# EAGLE board LED_panel_rev3.15 (EAGLE 9.0.1), part 1 of 2
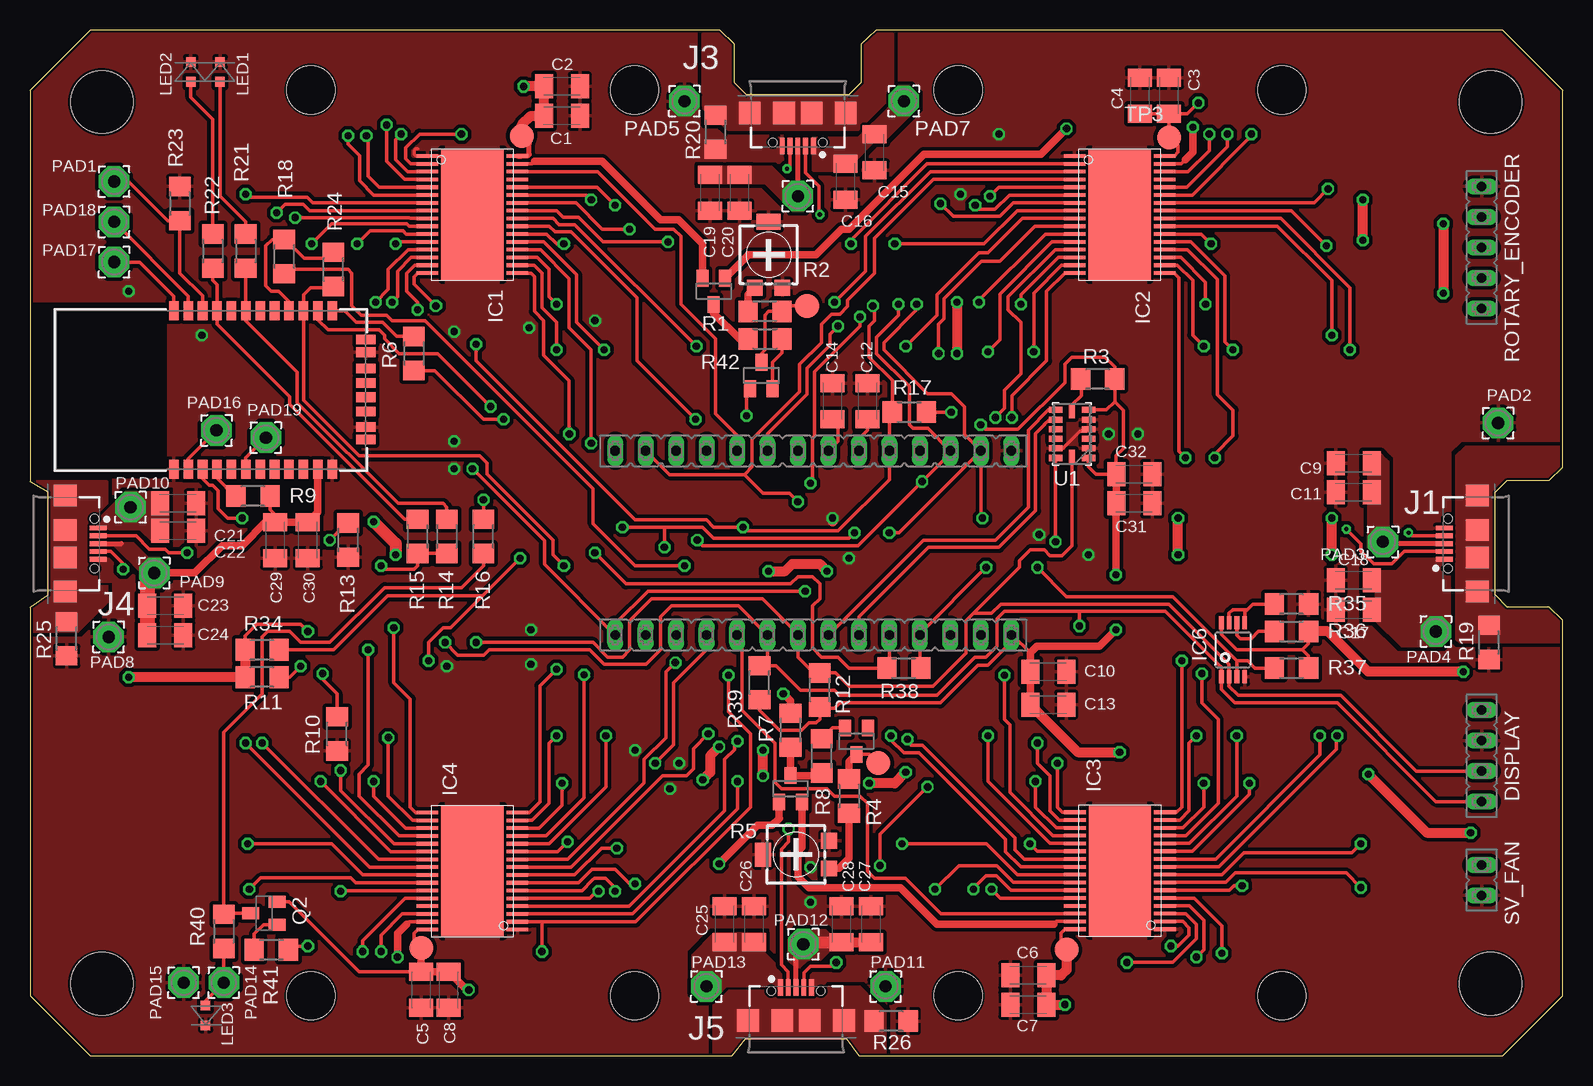
[diagram p7: board, top side]
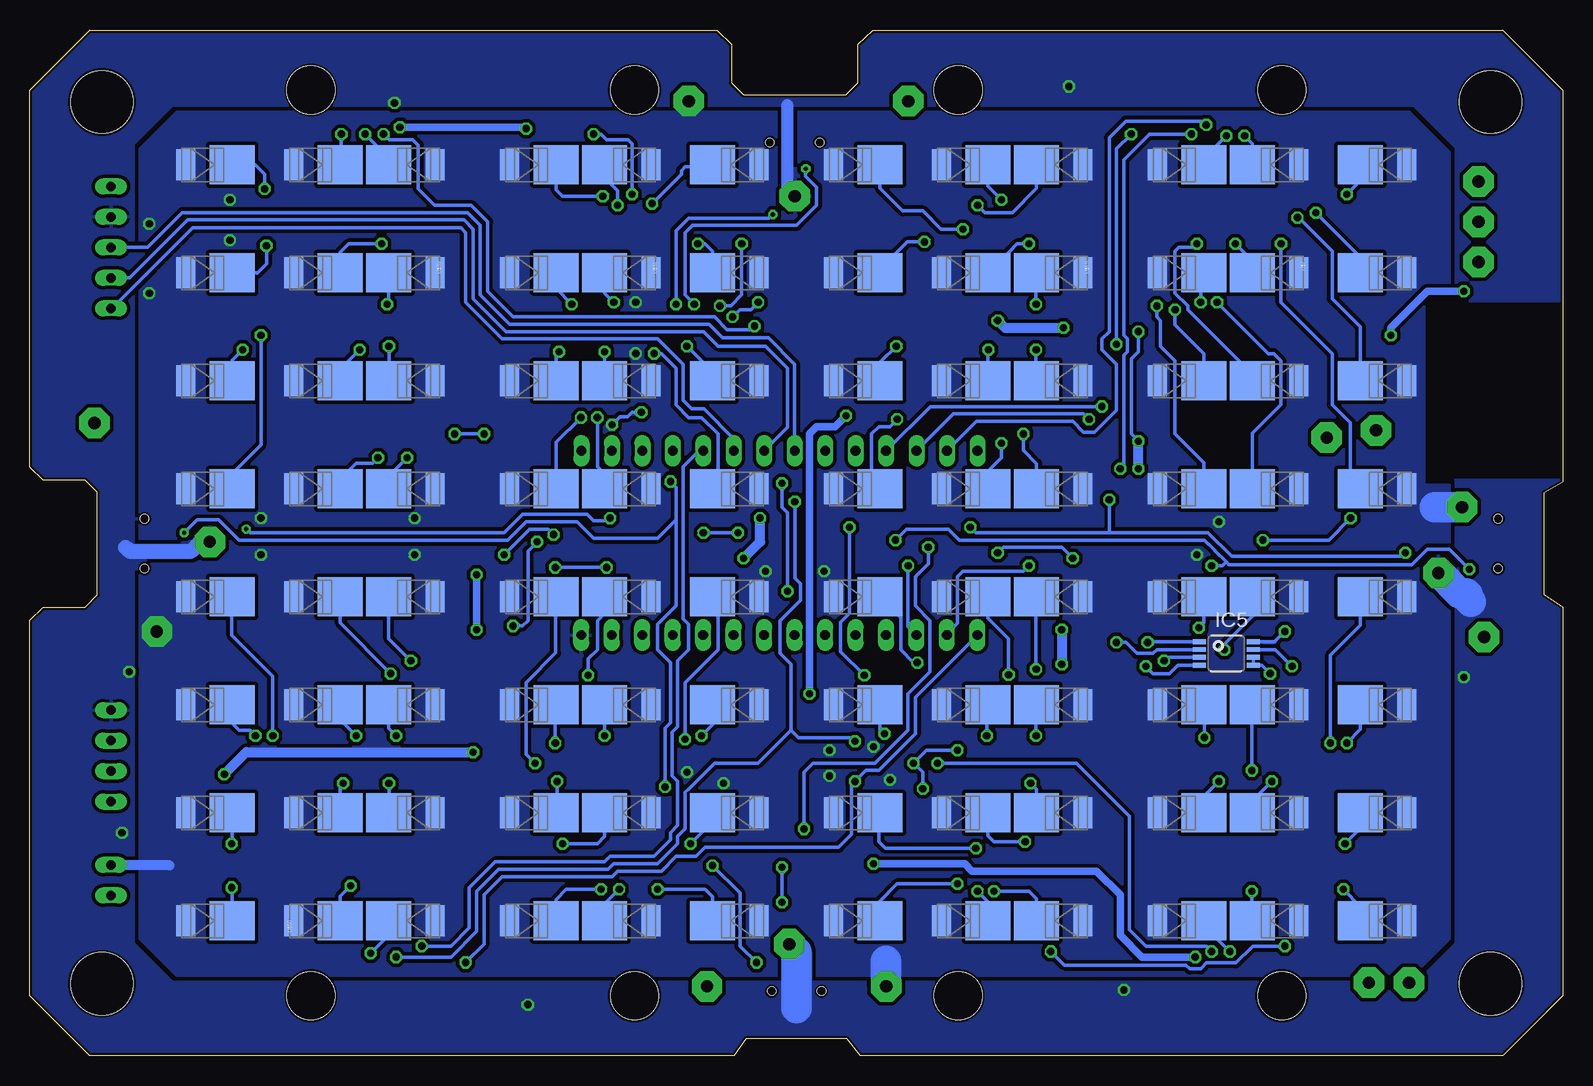
[diagram p8: board, bottom side, seen from below]

Size 127.76 x 85.48 mm. Coordinates in mm from the lower left corner, seen from the top.
Outline: 5,0 58.52,0 59.64,1.41 68.08,1.41 69.09,0 122.76,0 127.76,5 127.76,36.3 126.67,37.39 123.16,37.39 122.15,38.41 122.15,46.94 123.16,47.95 126.67,47.95 127.76,49.05 127.76,80.48 122.76,85.48 70.51,85.48 69.29,84.31 69.29,81.08 68.28,80.07 59.74,80.07 58.73,81.08 58.73,84.31 57.51,85.48 5,85.48 0,80.48 0,47.85 1.51,46.94 1.51,38.41 0,37.39 0,5 5,0
Copper layers (1*16): Top 0.035mm / dielectric 1mm / Bottom 0.035mm
Design rules "default *": minimum track width 6mil, minimum drill 0.3mm, track to track 8mil, track to pad 8mil, pad to pad 8mil, via to via 8mil, smd to smd 8mil, copper to edge 0.2mm, drill to drill 8mil, minimum pad ring 10mil, minimum via ring 8mil, stop-mask expansion 0mil, vias tented up to drill 0mil, thermal gap 10mil
Net classes: 1 supply: width 0.152 mm, clearance 0.229 mm to class 0, clearance 0.305 mm
Holes 5.2 mm at 6,79.48 6,6 121.76,79.48 121.76,6
Holes 4 mm at 50.39,5 77.37,5 23.41,5 104.35,5 50.39,80.48 77.37,80.48 23.41,80.48 104.35,80.48

## Footprints (pad centres in the part's own frame; a part is rotated, then mirrored left to right if it is on the bottom)
C1206K = smd 1.5 x 2: 1 -1.5,0; 2 1.5,0
FE04 = drill 0.813 long: 1 -3.81,0; 2 -1.27,0; 3 1.27,0; 4 3.81,0
FE14 = drill 0.813 long: 1 -16.51,0; 2 -13.97,0; 3 -11.43,0; 4 -8.89,0; 5 -6.35,0; 6 -3.81,0; 7 -1.27,0; 8 1.27,0; 9 3.81,0; 10 6.35,0; 11 8.89,0; 12 11.43,0; 13 13.97,0; 14 16.51,0
HTSSOP32DAP = smd 0.3 x 1.8: 1 -4.875,-3.75; 2 -4.225,-3.75; 3 -3.575,-3.75; 4 -2.925,-3.75; 5 -2.275,-3.75; 6 -1.625,-3.75; 7 -0.975,-3.75; 8 -0.325,-3.75; 9 0.325,-3.75; 10 0.975,-3.75; 11 1.625,-3.75; 12 2.275,-3.75; 13 2.925,-3.75; 14 3.575,-3.75; 15 4.225,-3.75; 16 4.875,-3.75; 17 4.875,3.75; 18 4.225,3.75; 19 3.575,3.75; 20 2.925,3.75; 21 2.275,3.75; 22 1.625,3.75; 23 0.975,3.75; 24 0.325,3.75; 25 -0.325,3.75; 26 -0.975,3.75; 27 -1.625,3.75; 28 -2.275,3.75; 29 -2.925,3.75; 30 -3.575,3.75; 31 -4.225,3.75; 32 -4.875,3.75 | smd 11 x 5.2: EXP 0,0
MSOP8 = smd 0.4 x 1.1: 1 -0.975,-2.25; 2 -0.325,-2.25; 3 0.325,-2.25; 4 0.975,-2.25; 5 0.975,2.25; 6 0.325,2.25; 7 -0.325,2.25; 8 -0.975,2.25
629105136821 = smd 0.4 x 1.4: 1 -1.3,0.5; 2 -0.65,0.5; 3 0,0.5; 4 0.65,0.5; 5 1.3,0.5 | smd 1.8 x 1.9: 6 1.15,-2.25; 7 -1.15,-2.25; 8 4,-2.25; 9 -4,-2.25 | hole 0.7: -2.075,0.2; 2.075,0.2
MH_KINGBRIGHT_1.6X0.8 = smd 0.8 x 0.8: A 0.825,0; C -0.825,0
2,54/1,0 = drill 1.016 pad 2.54 octagon: 1 0,0
SOT23-BEC = smd 1 x 1.4: B -0.95,-1.1; C 0,1.1; E 0.95,-1.1
R1206 = smd 1.6 x 1.803: 1 -1.422,0; 2 1.422,0
RTRIM4G/J = smd 1.3 x 1.3: 1 -1.15,-2.75; 3 1.15,-2.75 | smd 2 x 1.3: 2 0,2.75
FE05 = drill 0.813 long: 1 -5.08,0; 2 -2.54,0; 3 0,0; 4 2.54,0; 5 5.08,0
FE02 = drill 0.813 long: 1 -1.27,0; 2 1.27,0
TP20R = smd 2 x 2: TP 0,0
LGA14R80P3X6_300X500X100 = smd 1.118 x 0.508: 1 -1.372,2.007; 2 -1.372,1.194; 3 -1.372,0.406; 4 -1.372,-0.406; 5 -1.372,-1.194; 6 -1.372,-2.007; 8 1.372,-2.007; 9 1.372,-1.194; 10 1.372,-0.406; 11 1.372,0.406; 12 1.372,1.194; 13 1.372,2.007 | smd 0.508 x 1.118: 7 0,-1.88; 14 0,1.88
SMD_CERAMIC_MID_POWER = smd 2.6 x 1.6: P$1 0,1.4 | smd 3.26 x 3.75: P$2 0,-2.475
RN41 = smd 0.8 x 1.6: 1 -6.6,-6.6; 2 -5.4,-6.6; 3 -4.2,-6.6; 4 -3,-6.6; 5 -1.8,-6.6; 6 -0.6,-6.6; 7 0.6,-6.6; 8 1.8,-6.6; 9 3,-6.6; 10 4.2,-6.6; 11 5.4,-6.6; 12 6.6,-6.6; 13 6.6,6.6; 14 5.4,6.6; 15 4.2,6.6; 16 3,6.6; 17 1.8,6.6; 18 0.6,6.6; 19 -0.6,6.6; 20 -1.8,6.6; 21 -3,6.6; 22 -4.2,6.6; 23 -5.4,6.6; 24 -6.6,6.6 | smd 1.6 x 0.8: 28 9.4,3.15; 29 9.4,-3.08; 30 9.4,4.2; 31 9.4,1.8; 32 9.4,0.6; 33 9.4,-0.6; 34 9.4,-1.8; 35 9.4,-4.12
SOT23 = smd 1 x 1.4: 1 -0.95,-1.1; 2 0.95,-1.1; 3 0,1.1

## Placement (x,y rotation side)
C1  100n  [C1206K]  44.35,78.33 180 top
C2  10u/16V  [C1206K]  44.35,80.77 180 top
C3  100n  [C1206K]  94.95,80.01 270 top
C4  10u/16V  [C1206K]  92.51,80.01 270 top
C5  100n  [C1206K]  32.61,5.49 90 top
C6  10u/16V  [C1206K]  83.21,6.71 0 top
C7  100n  [C1206K]  83.21,4.27 0 top
C8  10u/16V  [C1206K]  34.9,5.49 90 top
C9  100n  [C1206K]  110.34,49.38 180 top
C10  100n  [C1206K]  84.89,32 0 top
C11  100u / 6V3  [C1206K]  110.34,46.94 180 top
C12  100n  [C1206K]  66.9,54.56 270 top
C13  10u/16V  [C1206K]  84.89,29.26 0 top
C14  100n  [C1206K]  69.8,54.56 270 top
C15  100n  [C1206K]  70.41,75.29 270 top
C16  100u / 6V3  [C1206K]  67.97,72.85 270 top
C17  100n  [C1206K]  110.34,37.19 180 top
C18  100u / 6V3  [C1206K]  110.34,39.62 180 top
C19  100n  [C1206K]  56.69,71.93 270 top
C20  100u / 6V3  [C1206K]  59.13,71.93 270 top
C21  100n  [C1206K]  12.34,46.02 0 top
C22  100u / 6V3  [C1206K]  12.34,43.74 0 top
C23  100n  [C1206K]  11.28,37.49 0 top
C24  100u / 6V3  [C1206K]  11.28,35.05 0 top
C25  100n  [C1206K]  57.91,10.97 90 top
C26  100u / 6V3  [C1206K]  60.35,10.97 90 top
C27  100n  [C1206K]  70.1,10.97 90 top
C28  100u / 6V3  [C1206K]  67.67,10.97 90 top
C29  10u/16V  [C1206K]  20.42,42.98 270 top
C30  100n  [C1206K]  23.16,42.98 270 top
C31  10u/16V  [C1206K]  92.05,46.02 0 top
C32  100n  [C1206K]  92.05,48.46 0 top
DISPLAY  FE04-1  [FE04]  121.01,24.99 90 top
FE01  FE14-1  [FE14]  65.29,50.42 180 top
FE02  FE14-1  [FE14]  65.3,35.06 0 top
IC1  TLC5947-DAP  [HTSSOP32DAP]  36.88,70.1 270 top
IC2  TLC5947-DAP  [HTSSOP32DAP]  90.83,70.1 270 top
IC3  TLC5947-DAP  [HTSSOP32DAP]  90.86,15.42 90 top
IC4  TLC5947-DAP  [HTSSOP32DAP]  36.88,15.39 90 top
IC5  MCP9808  [MSOP8]  28.04,33.53 270 bottom
IC6  MCP9808  [MSOP8]  100.28,33.83 0 top
J1  WE_629105136821  [629105136821]  118.41,42.67 90 top
J3  WE_629105136821  [629105136821]  64.01,76.31 180 top
J4  WE_629105136821  [629105136821]  5.18,42.67 270 top
J5  WE_629105136821  [629105136821]  63.86,5.18 0 top
LED1  KPT-1608LVSECK-J3-PRV  [MH_KINGBRIGHT_1.6X0.8]  15.85,81.99 270 top
LED2  KPT-1608LVZGCK  [MH_KINGBRIGHT_1.6X0.8]  13.41,81.99 270 top
LED3  KPT-1608LVSECK-J3-PRV  [MH_KINGBRIGHT_1.6X0.8]  14.63,3.35 90 top
PAD1  [2,54/1,0]  7.01,72.85 90 top
PAD2  GND  [2,54/1,0]  122.38,52.73 0 top
PAD3  +3V3  [2,54/1,0]  112.78,42.82 0 top
PAD4  VCC  [2,54/1,0]  117.2,35.36 0 top
PAD5  GND  [2,54/1,0]  54.56,79.55 0 top
PAD6  +3V3  [2,54/1,0]  64.01,71.63 0 top
PAD7  VCC  [2,54/1,0]  72.85,79.55 0 top
PAD8  GND  [2,54/1,0]  6.55,34.9 0 top
PAD9  +3V3  [2,54/1,0]  10.36,40.23 0 top
PAD10  VCC  [2,54/1,0]  8.38,45.72 0 top
PAD11  GND  [2,54/1,0]  71.32,5.79 0 top
PAD12  +3V3  [2,54/1,0]  64.47,9.3 0 top
PAD13  VCC  [2,54/1,0]  56.39,5.79 0 top
PAD14  [2,54/1,0]  16.15,6.1 0 top
PAD15  [2,54/1,0]  12.8,6.1 0 top
PAD16  [2,54/1,0]  15.54,52.12 0 top
PAD17  [2,54/1,0]  7.01,66.14 0 top
PAD18  [2,54/1,0]  7.01,69.49 0 top
PAD19  [2,54/1,0]  19.66,51.51 0 top
Q2  BC807-16SMD  [SOT23-BEC]  19.51,11.89 90 top
R1  1K  [R1206]  61.26,62.03 0 top
R2  5K  [RTRIM4G/J]  61.57,66.75 0 top
R3  10K  [R1206]  89,56.39 0 top
R4  1K  [R1206]  68.28,21.64 90 top
R5  5K  [RTRIM4G/J]  63.86,16.76 90 top
R6  1K  [R1206]  32,58.52 90 top
R7  0R  [R1206]  63.4,27.13 270 top
R8  0R  [R1206]  65.99,24.99 270 top
R9  10K  [R1206]  18.59,46.63 0 top
R10  10K  [R1206]  25.6,26.82 270 top
R11  10K  [R1206]  19.35,31.55 0 top
R12  4K7  [R1206]  65.84,30.48 270 top
R13  10K  [R1206]  26.52,42.98 90 top
R14  0R  [R1206]  34.75,43.28 90 top
R15  0R  [R1206]  32.31,43.28 90 top
R16  0R  [R1206]  37.8,43.28 270 top
R17  10K  [R1206]  73.3,53.64 180 top
R18  1K  [R1206]  21.18,66.6 90 top
R19  0R  [R1206]  121.62,34.44 270 top
R20  0R  [R1206]  57.15,76.96 270 top
R21  750R  [R1206]  17.98,67.06 90 top
R22  330R  [R1206]  15.24,67.06 90 top
R23  10K  [R1206]  12.5,71.02 90 top
R24  0R  [R1206]  25.3,65.53 270 top
R25  0R  [R1206]  3.05,34.75 270 top
R26  0R  [R1206]  71.78,2.9 0 top
R34  10K  [R1206]  19.35,33.83 0 top
R35  10K  [R1206]  105.16,37.64 0 top
R36  10K  [R1206]  105.16,35.36 180 top
R37  10K  [R1206]  105.16,32.31 180 top
R38  0R  [R1206]  72.85,32.31 180 top
R39  4K7  [R1206]  60.81,31.09 270 top
R40  750R  [R1206]  16.15,10.36 90 top
R41  1K  [R1206]  20.12,8.84 180 top
R42  0R  [R1206]  61.26,59.74 180 top
ROTARY_ENCODER  FE05-1  [FE05]  121.01,67.36 270 top
SV_FAN  FE02-1  [FE02]  121.01,14.63 270 top
TP1  TPTP20R  [TP20R]  41,76.66 0 top
TP3  TPTP20R  [TP20R]  94.95,76.5 0 top
TP5  TPTP20R  [TP20R]  86.41,8.84 0 top
TP7  TPTP20R  [TP20R]  32.61,8.99 0 top
TP9  TPTP20R  [TP20R]  64.77,62.48 0 top
TP10  TPTP20R  [TP20R]  70.71,24.38 0 top
U1  ADXL345BCCZ  [LGA14R80P3X6_300X500X100]  86.87,51.82 180 top
U$1  VLMU1610-365-135  [SMD_CERAMIC_MID_POWER]  32.38,74.24 90 bottom
U$2  VLMU1610-365-135  [SMD_CERAMIC_MID_POWER]  23.38,74.24 270 bottom
U$3  VLMU1610-365-135  [SMD_CERAMIC_MID_POWER]  14.38,74.24 270 bottom
U$4  VLMU1610-365-135  [SMD_CERAMIC_MID_POWER]  14.38,65.24 270 bottom
U$5  VLMU1610-365-135  [SMD_CERAMIC_MID_POWER]  14.38,56.24 270 bottom
U$6  VLMU1610-365-135  [SMD_CERAMIC_MID_POWER]  14.38,47.24 270 bottom
U$7  VLMU1610-365-135  [SMD_CERAMIC_MID_POWER]  23.38,65.24 270 bottom
U$8  VLMU1610-365-135  [SMD_CERAMIC_MID_POWER]  23.38,56.24 270 bottom
U$9  VLMU1610-365-135  [SMD_CERAMIC_MID_POWER]  23.38,47.24 270 bottom
U$10  VLMU1610-365-135  [SMD_CERAMIC_MID_POWER]  32.38,65.24 90 bottom
U$11  VLMU1610-365-135  [SMD_CERAMIC_MID_POWER]  32.38,56.24 90 bottom
U$12  VLMU1610-365-135  [SMD_CERAMIC_MID_POWER]  32.38,47.24 90 bottom
U$13  VLMU1610-365-135  [SMD_CERAMIC_MID_POWER]  41.38,47.24 270 bottom
U$14  VLMU1610-365-135  [SMD_CERAMIC_MID_POWER]  41.38,56.24 270 bottom
U$15  VLMU1610-365-135  [SMD_CERAMIC_MID_POWER]  41.38,65.24 270 bottom
U$16  VLMU1610-365-135  [SMD_CERAMIC_MID_POWER]  50.38,47.24 90 bottom
U$17  VLMU1610-365-135  [SMD_CERAMIC_MID_POWER]  50.38,56.24 90 bottom
U$18  VLMU1610-365-135  [SMD_CERAMIC_MID_POWER]  50.38,65.24 90 bottom
U$19  VLMU1610-365-135  [SMD_CERAMIC_MID_POWER]  59.38,47.24 90 bottom
U$20  VLMU1610-365-135  [SMD_CERAMIC_MID_POWER]  59.38,56.24 90 bottom
U$21  VLMU1610-365-135  [SMD_CERAMIC_MID_POWER]  59.38,65.24 90 bottom
U$22  VLMU1610-365-135  [SMD_CERAMIC_MID_POWER]  59.38,74.24 90 bottom
U$23  VLMU1610-365-135  [SMD_CERAMIC_MID_POWER]  50.38,74.24 90 bottom
U$24  VLMU1610-365-135  [SMD_CERAMIC_MID_POWER]  41.38,74.24 270 bottom
U$25  VLMU1610-365-135  [SMD_CERAMIC_MID_POWER]  86.38,74.24 90 bottom
U$26  VLMU1610-365-135  [SMD_CERAMIC_MID_POWER]  77.38,74.24 270 bottom
U$27  VLMU1610-365-135  [SMD_CERAMIC_MID_POWER]  68.38,74.24 270 bottom
U$28  VLMU1610-365-135  [SMD_CERAMIC_MID_POWER]  68.38,65.24 270 bottom
U$29  VLMU1610-365-135  [SMD_CERAMIC_MID_POWER]  68.38,56.24 270 bottom
U$30  VLMU1610-365-135  [SMD_CERAMIC_MID_POWER]  68.38,47.24 270 bottom
U$31  VLMU1610-365-135  [SMD_CERAMIC_MID_POWER]  77.38,65.24 270 bottom
U$32  VLMU1610-365-135  [SMD_CERAMIC_MID_POWER]  77.38,56.24 270 bottom
U$33  VLMU1610-365-135  [SMD_CERAMIC_MID_POWER]  77.38,47.24 270 bottom
U$34  VLMU1610-365-135  [SMD_CERAMIC_MID_POWER]  86.38,65.24 90 bottom
U$35  VLMU1610-365-135  [SMD_CERAMIC_MID_POWER]  86.38,56.24 90 bottom
U$36  VLMU1610-365-135  [SMD_CERAMIC_MID_POWER]  86.38,47.24 90 bottom
U$37  VLMU1610-365-135  [SMD_CERAMIC_MID_POWER]  95.38,47.24 270 bottom
U$38  VLMU1610-365-135  [SMD_CERAMIC_MID_POWER]  95.38,56.24 270 bottom
U$39  VLMU1610-365-135  [SMD_CERAMIC_MID_POWER]  95.38,65.24 270 bottom
U$40  VLMU1610-365-135  [SMD_CERAMIC_MID_POWER]  104.38,47.24 90 bottom
U$41  VLMU1610-365-135  [SMD_CERAMIC_MID_POWER]  104.38,56.24 90 bottom
U$42  VLMU1610-365-135  [SMD_CERAMIC_MID_POWER]  104.38,65.24 90 bottom
U$43  VLMU1610-365-135  [SMD_CERAMIC_MID_POWER]  113.38,47.24 90 bottom
U$44  VLMU1610-365-135  [SMD_CERAMIC_MID_POWER]  113.38,56.24 90 bottom
U$45  VLMU1610-365-135  [SMD_CERAMIC_MID_POWER]  113.38,65.24 90 bottom
U$46  VLMU1610-365-135  [SMD_CERAMIC_MID_POWER]  113.38,74.24 90 bottom
U$47  VLMU1610-365-135  [SMD_CERAMIC_MID_POWER]  104.38,74.24 90 bottom
U$48  VLMU1610-365-135  [SMD_CERAMIC_MID_POWER]  95.38,74.24 270 bottom
U$49  VLMU1610-365-135  [SMD_CERAMIC_MID_POWER]  95.38,11.24 270 bottom
U$50  VLMU1610-365-135  [SMD_CERAMIC_MID_POWER]  104.38,11.24 90 bottom
U$51  VLMU1610-365-135  [SMD_CERAMIC_MID_POWER]  113.38,11.24 90 bottom
U$52  VLMU1610-365-135  [SMD_CERAMIC_MID_POWER]  113.38,20.24 90 bottom
U$53  VLMU1610-365-135  [SMD_CERAMIC_MID_POWER]  113.38,29.24 90 bottom
U$54  VLMU1610-365-135  [SMD_CERAMIC_MID_POWER]  113.38,38.24 90 bottom
U$55  VLMU1610-365-135  [SMD_CERAMIC_MID_POWER]  104.38,20.24 90 bottom
U$56  VLMU1610-365-135  [SMD_CERAMIC_MID_POWER]  104.38,29.24 90 bottom
U$57  VLMU1610-365-135  [SMD_CERAMIC_MID_POWER]  104.38,38.24 90 bottom
U$58  VLMU1610-365-135  [SMD_CERAMIC_MID_POWER]  95.38,20.24 270 bottom
U$59  VLMU1610-365-135  [SMD_CERAMIC_MID_POWER]  95.38,29.24 270 bottom
U$60  VLMU1610-365-135  [SMD_CERAMIC_MID_POWER]  95.38,38.24 270 bottom
U$61  VLMU1610-365-135  [SMD_CERAMIC_MID_POWER]  86.38,38.24 90 bottom
U$62  VLMU1610-365-135  [SMD_CERAMIC_MID_POWER]  86.38,29.24 90 bottom
U$63  VLMU1610-365-135  [SMD_CERAMIC_MID_POWER]  86.38,20.24 90 bottom
U$64  VLMU1610-365-135  [SMD_CERAMIC_MID_POWER]  77.38,38.24 270 bottom
U$65  VLMU1610-365-135  [SMD_CERAMIC_MID_POWER]  77.38,29.24 270 bottom
U$66  VLMU1610-365-135  [SMD_CERAMIC_MID_POWER]  77.38,20.24 270 bottom
U$67  VLMU1610-365-135  [SMD_CERAMIC_MID_POWER]  68.38,38.24 270 bottom
U$68  VLMU1610-365-135  [SMD_CERAMIC_MID_POWER]  68.38,29.24 270 bottom
U$69  VLMU1610-365-135  [SMD_CERAMIC_MID_POWER]  68.38,20.24 270 bottom
U$70  VLMU1610-365-135  [SMD_CERAMIC_MID_POWER]  68.38,11.24 270 bottom
U$71  VLMU1610-365-135  [SMD_CERAMIC_MID_POWER]  77.38,11.24 270 bottom
U$72  VLMU1610-365-135  [SMD_CERAMIC_MID_POWER]  86.38,11.24 90 bottom
U$73  VLMU1610-365-135  [SMD_CERAMIC_MID_POWER]  41.38,11.24 270 bottom
U$74  VLMU1610-365-135  [SMD_CERAMIC_MID_POWER]  50.38,11.24 90 bottom
U$75  VLMU1610-365-135  [SMD_CERAMIC_MID_POWER]  59.38,11.24 90 bottom
U$76  VLMU1610-365-135  [SMD_CERAMIC_MID_POWER]  59.38,20.24 90 bottom
U$77  VLMU1610-365-135  [SMD_CERAMIC_MID_POWER]  59.38,29.24 90 bottom
U$78  VLMU1610-365-135  [SMD_CERAMIC_MID_POWER]  59.38,38.24 90 bottom
U$79  VLMU1610-365-135  [SMD_CERAMIC_MID_POWER]  50.38,20.24 90 bottom
U$80  VLMU1610-365-135  [SMD_CERAMIC_MID_POWER]  50.38,29.24 90 bottom
U$81  VLMU1610-365-135  [SMD_CERAMIC_MID_POWER]  50.38,38.24 90 bottom
U$82  VLMU1610-365-135  [SMD_CERAMIC_MID_POWER]  41.38,20.24 270 bottom
U$83  VLMU1610-365-135  [SMD_CERAMIC_MID_POWER]  41.38,29.24 270 bottom
U$84  VLMU1610-365-135  [SMD_CERAMIC_MID_POWER]  41.38,38.24 270 bottom
U$85  VLMU1610-365-135  [SMD_CERAMIC_MID_POWER]  32.38,38.24 90 bottom
U$86  VLMU1610-365-135  [SMD_CERAMIC_MID_POWER]  32.38,29.24 90 bottom
U$87  VLMU1610-365-135  [SMD_CERAMIC_MID_POWER]  32.38,20.24 90 bottom
U$88  VLMU1610-365-135  [SMD_CERAMIC_MID_POWER]  23.38,38.24 270 bottom
U$89  VLMU1610-365-135  [SMD_CERAMIC_MID_POWER]  23.38,29.24 270 bottom
U$90  VLMU1610-365-135  [SMD_CERAMIC_MID_POWER]  23.38,20.24 270 bottom
U$91  VLMU1610-365-135  [SMD_CERAMIC_MID_POWER]  14.38,38.24 270 bottom
U$92  VLMU1610-365-135  [SMD_CERAMIC_MID_POWER]  14.38,29.24 270 bottom
U$93  VLMU1610-365-135  [SMD_CERAMIC_MID_POWER]  14.38,20.24 270 bottom
U$94  VLMU1610-365-135  [SMD_CERAMIC_MID_POWER]  14.38,11.24 270 bottom
U$95  VLMU1610-365-135  [SMD_CERAMIC_MID_POWER]  23.38,11.24 270 bottom
U$96  VLMU1610-365-135  [SMD_CERAMIC_MID_POWER]  32.38,11.24 90 bottom
U$97  BLUETOOTH-RN-41"  [RN41]  18.59,55.47 0 top
U$98  BAS70-05-7-F  [SOT23]  57,63.7 180 top
U$99  LOGO_RESTRICT  [LOGO_RESTRICT]  107.24,50.22 0 top
U$100  BAS70-05-7-F  [SOT23]  63.4,22.25 0 top
U$101  BAS70-05-7-F  [SOT23]  60.96,56.69 0 top
U$102  BAS70-05-7-F  [SOT23]  68.88,26.21 180 top